# EAGLE design tm-feedback_main (EAGLE 7.6.0)
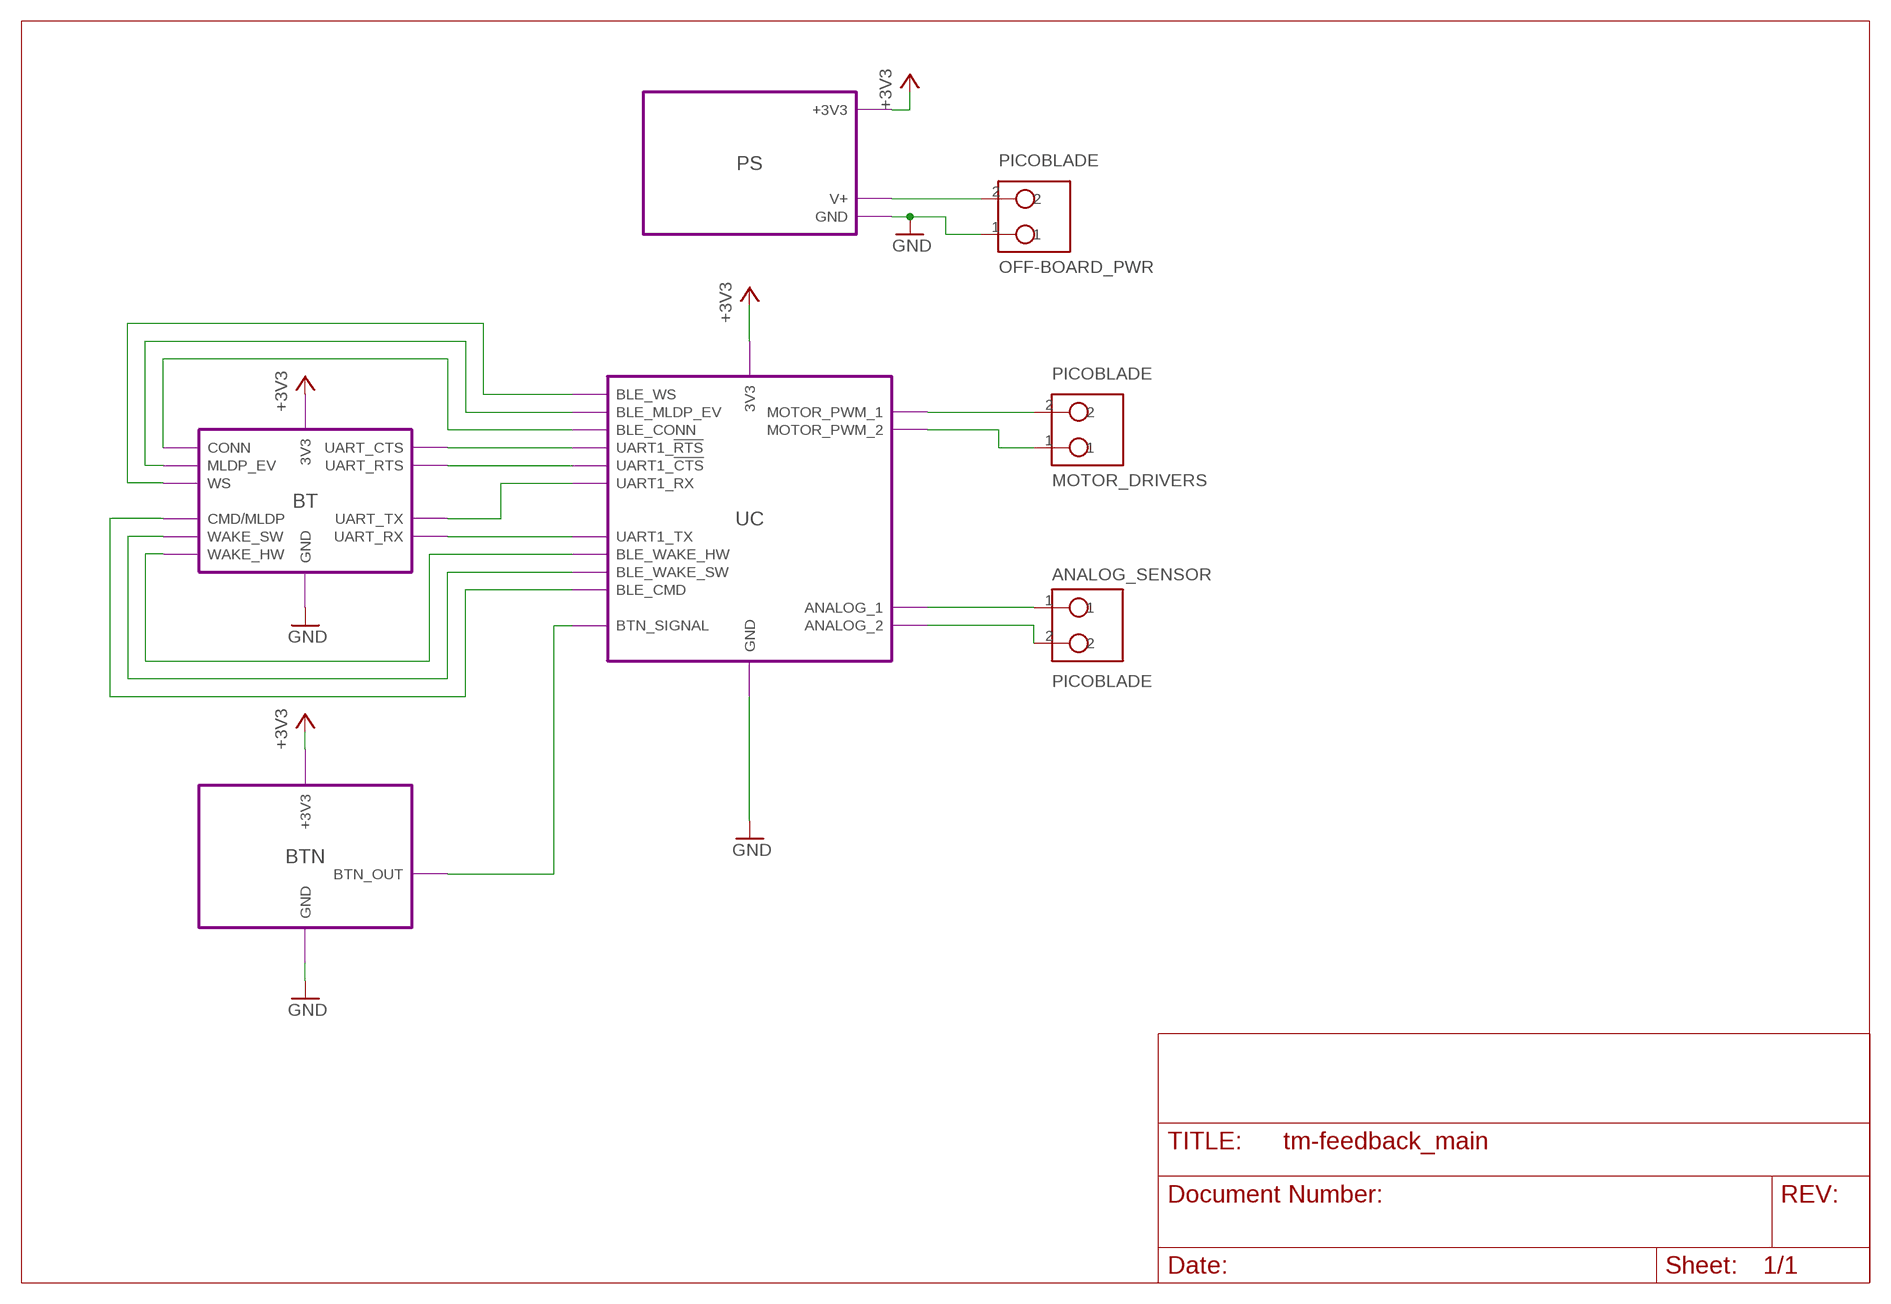
[diagram p0: schematic, sheet 1]

## Parts
ANALOG_SENSOR  PICOBLADE  [PICOBLADE]
MOTOR_DRIVERS  PICOBLADE  [PICOBLADE]
OFF-BOARD_PWR  PICOBLADE  [PICOBLADE]

## Module instances
BT = BLUETOOTH
UC = MICROCONTROLLER
BTN = BUTTON
PS = POWER_SUPPLY

## Nets
+3V3: port PS.+3V3 UC.3V3 BTN.+3V3 BT.3V3
GND: OFF-BOARD_PWR.1 ; port PS.GND BT.GND UC.GND BTN.GND
N$1: port BTN.BTN_OUT UC.BTN_SIGNAL
N$2: port BT.UART_CTS UC.UART1_!RTS
N$5: OFF-BOARD_PWR.2 ; port PS.V+
N$6: port BT.UART_RTS UC.UART1_!CTS
N$7: port BT.UART_TX UC.UART1_RX
N$8: port BT.UART_RX UC.UART1_TX
N$9: port BT.WAKE_HW UC.BLE_WAKE_HW
N$10: port BT.WAKE_SW UC.BLE_WAKE_SW
N$11: port BT.CMD/MLDP UC.BLE_CMD
N$12: port BT.CONN UC.BLE_CONN
N$13: port BT.MLDP_EV UC.BLE_MLDP_EV
N$14: port BT.WS UC.BLE_WS
N$15: ANALOG_SENSOR.1 ; port UC.ANALOG_1
N$16: ANALOG_SENSOR.2 ; port UC.ANALOG_2
PWM_1: MOTOR_DRIVERS.2 ; port UC.MOTOR_PWM_1
PWM_2: MOTOR_DRIVERS.1 ; port UC.MOTOR_PWM_2

## Library data of the parts
ANALOG_SENSOR MOTOR_DRIVERS OFF-BOARD_PWR = tactile-music:PICOBLADE: PICOBLADE connector

## Module BLUETOOTH
Ports: GND(pwr) UART_TX(out) UART_RX(in) UART_CTS(io) UART_RTS(io) CMD/MLDP(in) WAKE_SW(in) WAKE_HW(io) CONN(out) MLDP_EV(out) WS(out) 3V3(pwr)
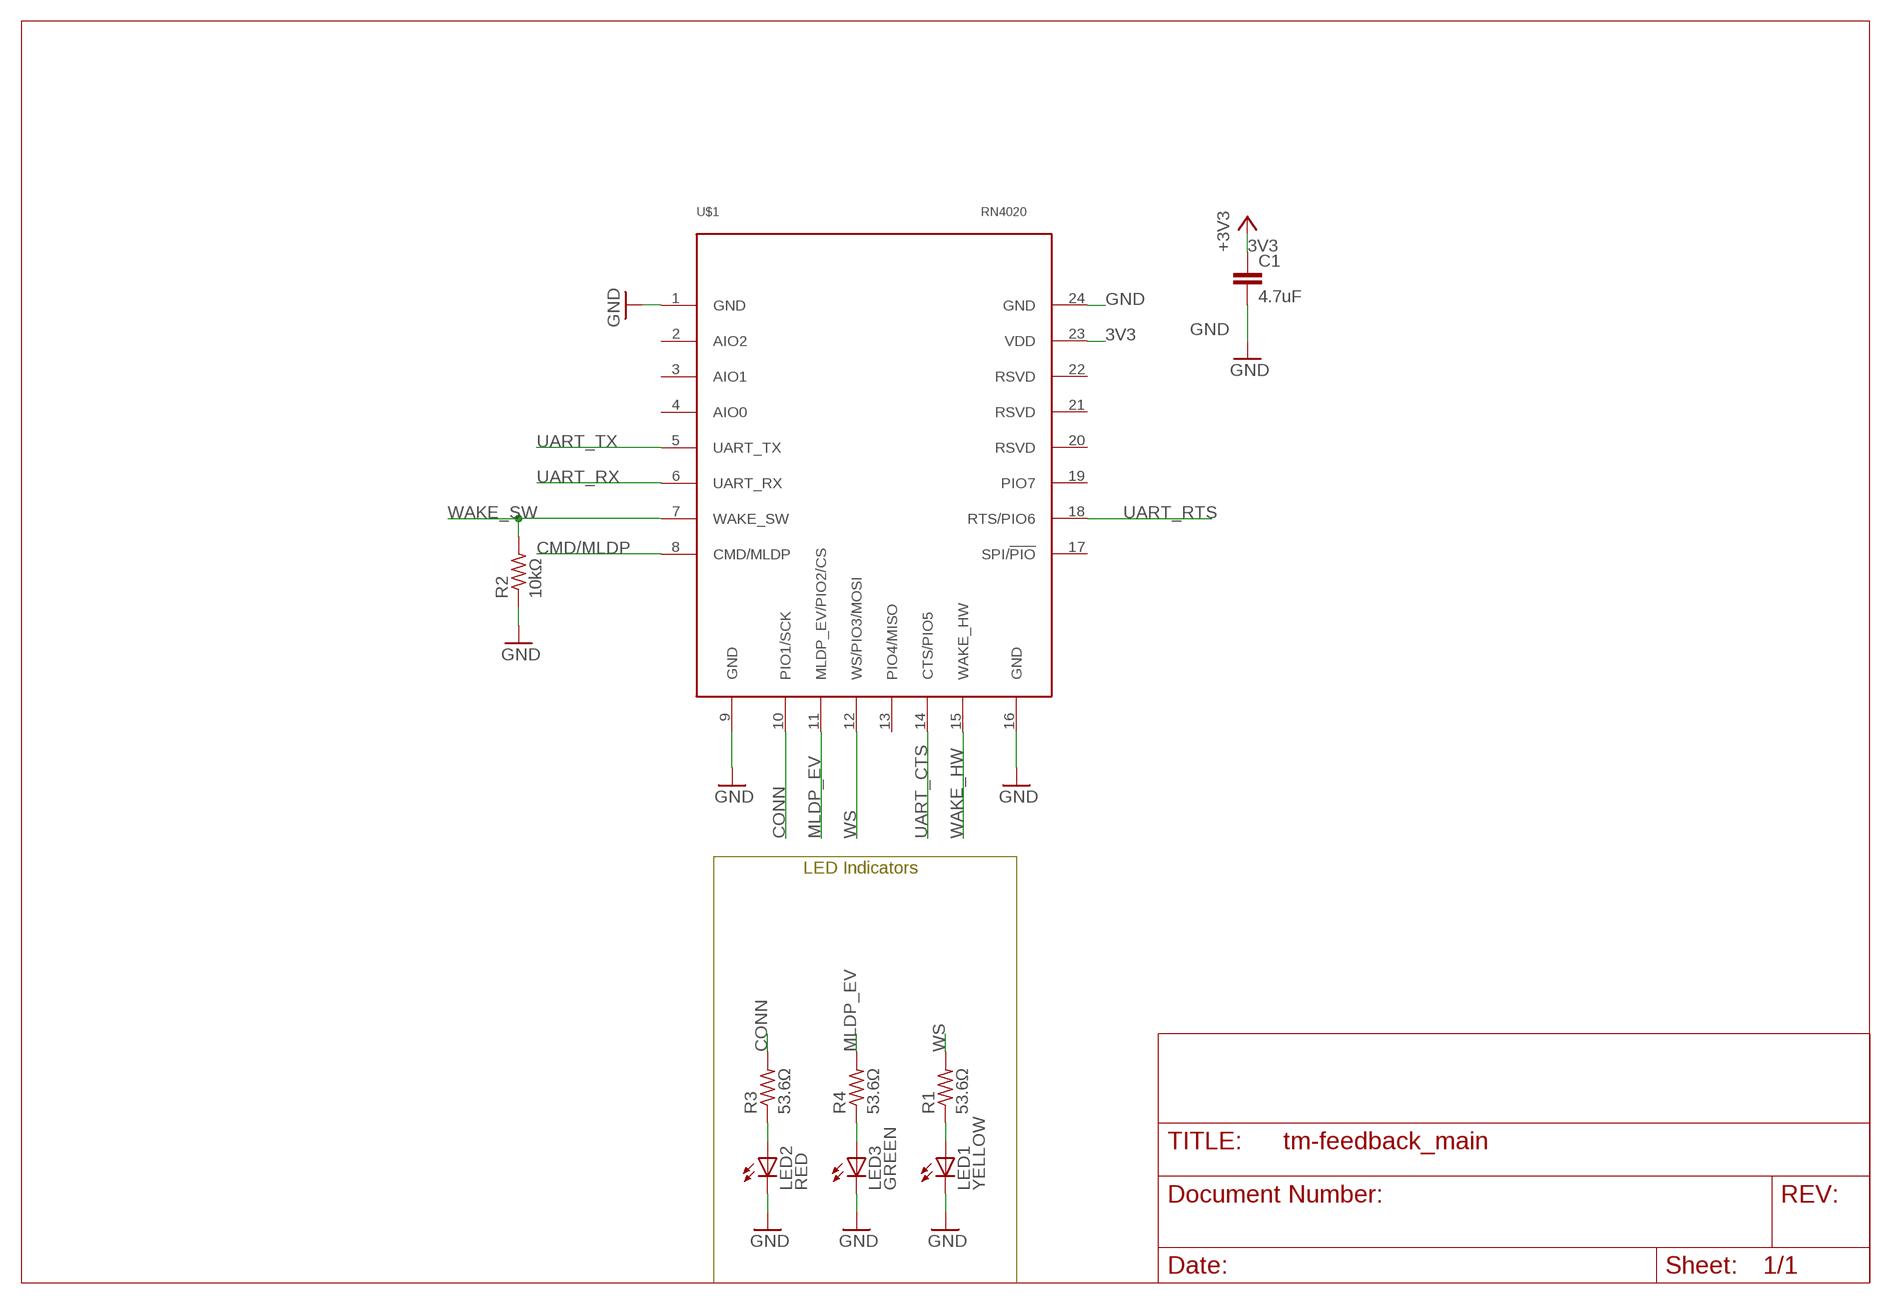
[diagram p1: schematic, module BLUETOOTH, sheet 1]

### Parts
C1  4.7uF  C-EUC0805  [C0805]
LED1  YELLOW  LEDCHIPLED_0805  [CHIPLED_0805]
LED2  RED  LEDCHIPLED_0805  [CHIPLED_0805]
LED3  GREEN  LEDCHIPLED_0805  [CHIPLED_0805]
R1  53.6Ω  R-US_R0805  [R0805]
R2  10kΩ  R-US_R0805  [R0805]
R3  53.6Ω  R-US_R0805  [R0805]
R4  53.6Ω  R-US_R0805  [R0805]
U$1  RN4020  [RN4020]

### Nets
3V3: C1.1 U$1.23(VDD) ; supply symbol labelled +3V3
CMD/MLDP: U$1.8(CMD/MLDP)
CONN: R3.2 U$1.10(PIO1/SCK)
GND: C1.2 LED1.C LED2.C LED3.C R2.1 U$1.1(GND) U$1.9(GND) U$1.16(GND) U$1.24(GND)
MLDP_EV: R4.2 U$1.11(MLDP_EV/PIO2/CS)
N$6: LED2.A R3.1
N$7: LED3.A R4.1
N$8: LED1.A R1.1
UART_CTS: U$1.14(CTS/PIO5)
UART_RTS: U$1.18(RTS/PIO6)
UART_RX: U$1.6(UART_RX)
UART_TX: U$1.5(UART_TX)
WAKE_HW: U$1.15(WAKE_HW)
WAKE_SW: R2.2 U$1.7(WAKE_SW)
WS: R1.2 U$1.12(WS/PIO3/MOSI)
Unconnected: U$1.2(AIO2) U$1.3(AIO1) U$1.4(AIO0) U$1.13(PIO4/MISO) U$1.17(SPI/!PIO) U$1.19(PIO7) U$1.20(RSVD) U$1.21(RSVD) U$1.22(RSVD)

### Notes on the sheet
- LED Indicators

### Library data of the parts
C1 = rcl:C-EU: CAPACITOR, European symbol
LED1-LED3 = led:LED: LED OSRAM: - CHIPLED LG R971, LG N971, LY N971, LG Q971, LY Q971, LO R971, LY R971 LH N974, LH R974 LS Q976, LO Q976, LY Q976 LO Q996 - Hyper CHIPLED LW Q18S LB Q993, LB Q99A, LB R99A - SideLED LS A670, LO A670, LY A670, LG A670, LP A670 LB A673, LV A673, LT A673, LW A673 LH A674 LY A675 LS A676, LA A676, LO A676, LY A676, LW A676 LS A679, LY A679, LG A679 - Hyper Micro SIDELED® LS Y876, LA Y876, LO Y876, LY Y876 LT Y87S - SmartLED LW L88C, LW L88S LB L89C, LB L89S, LG L890 LS L89K, LO L89K, LY L89K LS L896, LA L896, LO L896, LY L896 - TOPLED LS T670, LO T670, LY T670, LG T670, LP T670 LSG T670, LSP T670, LSY T670, LOP T670, LYG T670 LG T671, LOG T671, LSG T671 LB T673, LV T673, LT T673, LW T673 LH T674 LS T676, LA T676, LO T676, LY T676, LB T676, LH T676, LSB T676, LW T676 LB T67C, LV T67C, LT T67C, LS T67K, LO T67K, LY T67K, LW E67C LS E67B, LA E67B, LO E67B, LY E67B, LB E67C, LV E67C, LT E67C LW T67C LS T679, LY T679, LG T679 LS T770, LO T770, LY T770, LG T770, LP T770 LB T773, LV T773, LT T773, LW T773 LH T774 LS E675, LA E675, LY E675, LS T675 LS T776, LA T776, LO T776, LY T776, LB T776 LHGB T686 LT T68C, LB T68C - Hyper Mini TOPLED® LB M676 - Mini TOPLED Santana® LG M470 LS M47K, LO M47K, LY M47K Source: http://www.osram.convergy.de LUXEON: - LUMILED® LXK2-PW12-R00, LXK2-PW12-S00, LXK2-PW14-U00, LXK2-PW14-V00 LXK2-PM12-R00, LXK2-PM12-S00, LXK2-PM14-U00 LXK2-PE12-Q00, LXK2-PE12-R00, LXK2-PE12-S00, LXK2-PE14-T00, LXK2-PE14-U00 LXK2-PB12-K00, LXK2-PB12-L00, LXK2-PB12-M00, LXK2-PB14-N00, LXK2-PB14-P00, LXK2-PB14-Q00 LXK2-PR12-L00, LXK2-PR12-M00, LXK2-PR14-Q00, LXK2-PR14-R00 LXK2-PD12-Q00, LXK2-PD12-R00, LXK2-PD12-S00 LXK2-PH12-R00, LXK2-PH12-S00 LXK2-PL12-P00, LXK2-PL12-Q00, LXK2-PL12-R00 Source: www.luxeon.com KINGBRIGHT: KA-3528ASYC Source: www.kingbright.com
R1-R4 = resistor:R-US_: RESISTOR, American symbol
U$1 = tactile-music:RN4020: Microchip's RN4020 Bluetooth Module

## Module MICROCONTROLLER
Ports: 3V3(pwr) GND(pwr) MOTOR_PWM_1(out) MOTOR_PWM_2(out) BTN_SIGNAL(io) UART1_!CTS(io) UART1_!RTS(io) UART1_RX(io) UART1_TX(out) BLE_CONN(io) BLE_MLDP_EV(io) BLE_WS(io) BLE_WAKE_HW(out) BLE_WAKE_SW(out) BLE_CMD(out) ANALOG_2(io) ANALOG_1(io)
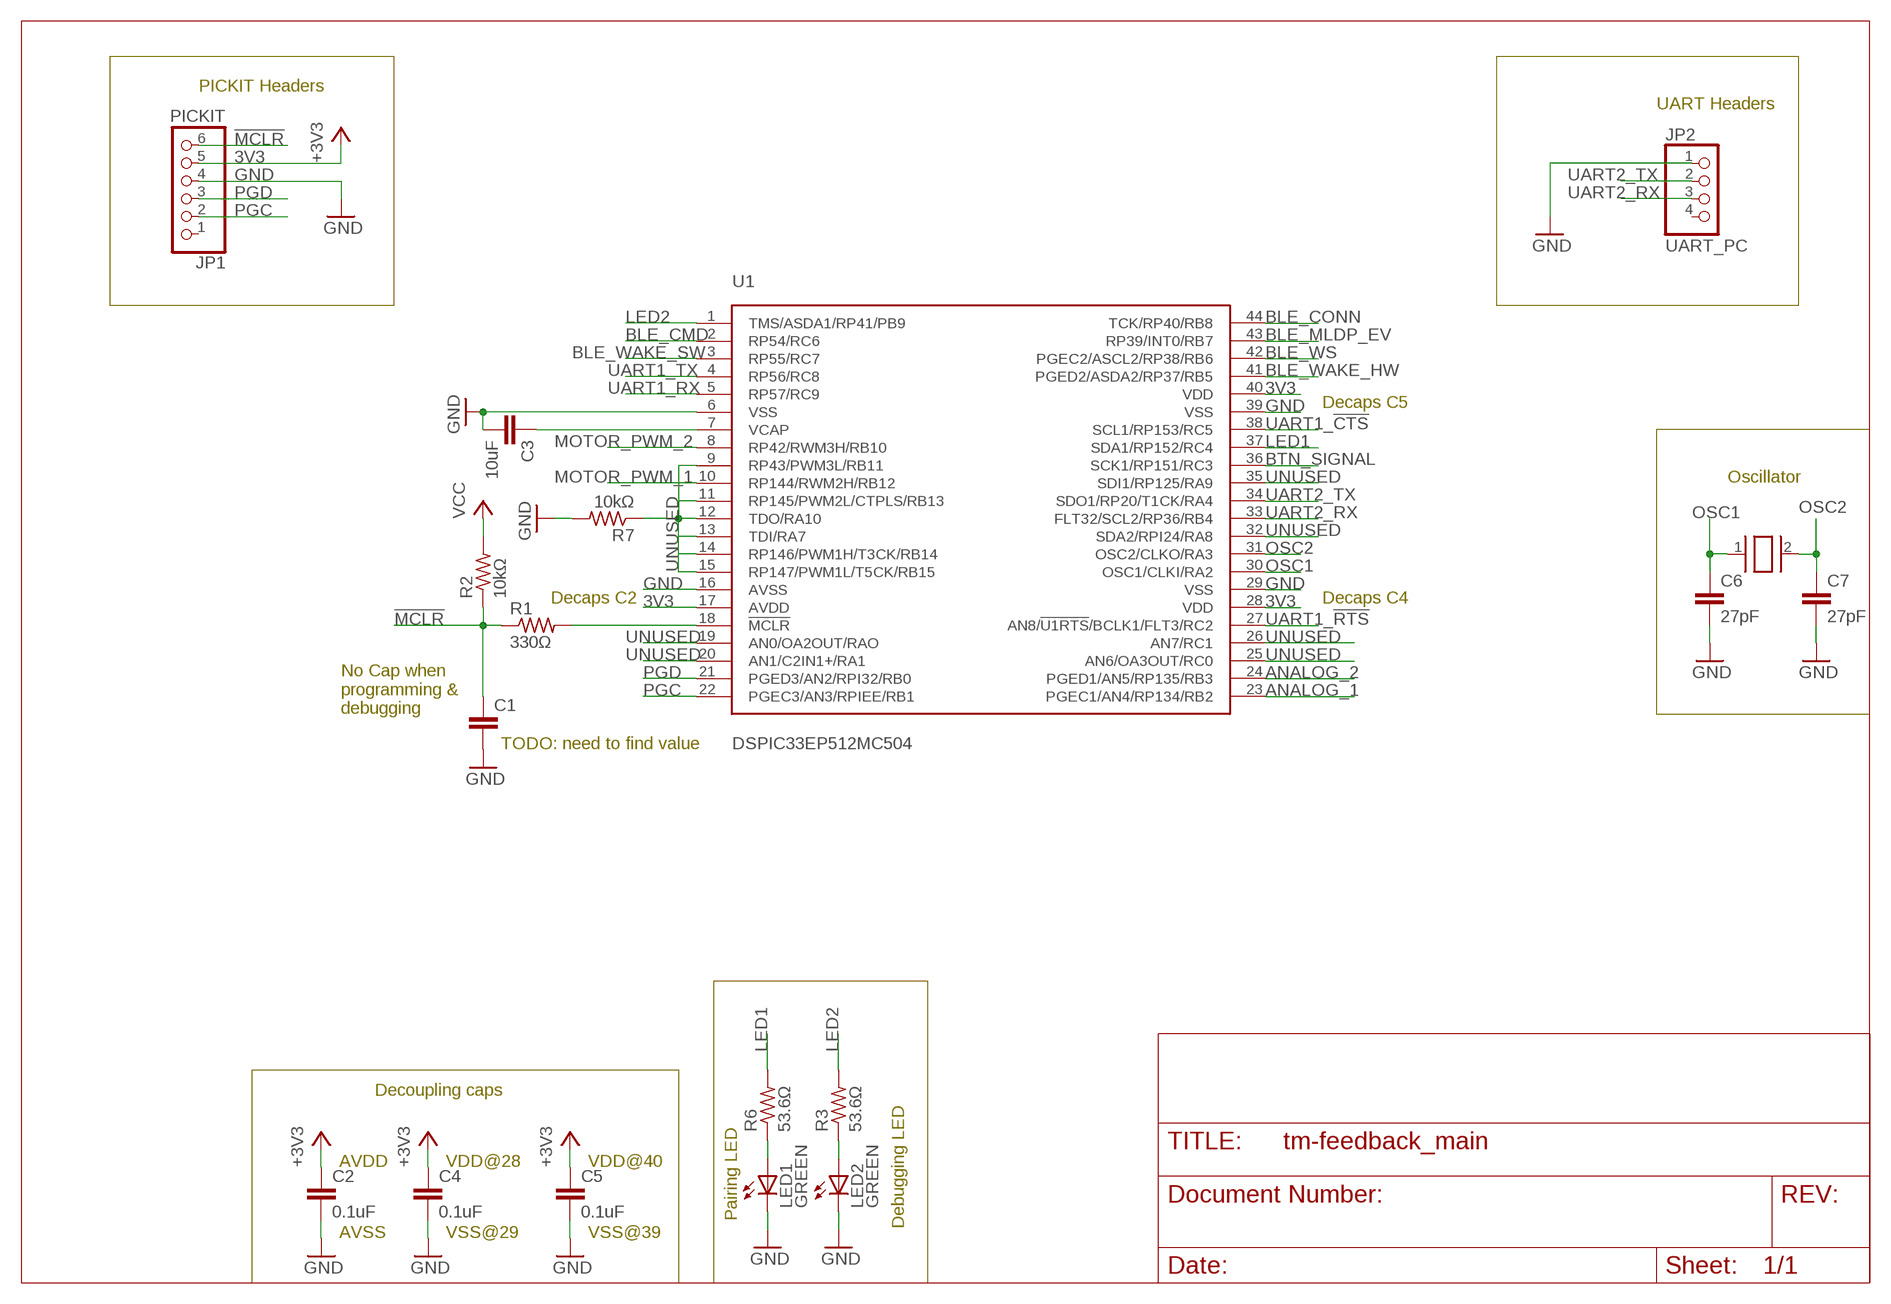
[diagram p2: schematic, module MICROCONTROLLER, sheet 1]

### Parts
C1  C-EUC0805  [C0805]
C2  0.1uF  C-EUC0805  [C0805]
C3  10uF  C-EUC0805  [C0805]
C4  0.1uF  C-EUC0805  [C0805]
C5  0.1uF  C-EUC0805  [C0805]
C6  27pF  C-EUC0805  [C0805]
C7  27pF  C-EUC0805  [C0805]
JP1  PICKIT  PINHEAD-1X6/90  [1X06/90]
JP2  UART_PC  PINHEAD-1X4/90  [1X04/90]
LED1  GREEN  LEDCHIPLED_0805  [CHIPLED_0805]
LED2  GREEN  LEDCHIPLED_0805  [CHIPLED_0805]
R1  330Ω  R-US_R0805  [R0805]
R2  10kΩ  R-US_R0805  [R0805]
R3  53.6Ω  R-US_R0805  [R0805]
R6  53.6Ω  R-US_R0805  [R0805]
R7  10kΩ  R-US_R0805  [R0805]
U1  DSPIC33EP512MC504  [TQFP44]
U2  XTAL_ABLS7M2  [XTAL_ABLS7M2]

### Nets
3V3: C2.1 C4.1 C5.1 JP1.5 R2.2 U1.17(AVDD) U1.28(VDD) U1.40(VDD) ; supply symbol labelled VCC, +3V3
!MCLR: C1.1 JP1.6 R1.1 R2.1
ANALOG_1: U1.23(PGEC1/AN4/RP134/RB2)
ANALOG_2: U1.24(PGED1/AN5/RP135/RB3)
BLE_CMD: U1.2(RP54/RC6)
BLE_CONN: U1.44(TCK/RP40/RB8)
BLE_MLDP_EV: U1.43(RP39/INT0/RB7)
BLE_WAKE_HW: U1.41(PGED2/ASDA2/RP37/RB5)
BLE_WAKE_SW: U1.3(RP55/RC7)
BLE_WS: U1.42(PGEC2/ASCL2/RP38/RB6)
BTN_SIGNAL: U1.36(SCK1/RP151/RC3)
GND: C1.2 C2.2 C3.2 C4.2 C5.2 C6.2 C7.2 JP1.4 JP2.1 LED1.C LED2.C R7.2 U1.6(VSS) U1.16(AVSS) U1.29(VSS) U1.39(VSS)
LED1: R6.2 U1.37(SDA1/RP152/RC4)
LED2: R3.2 U1.1(TMS/ASDA1/RP41/PB9)
MOTOR_PWM_1: U1.10(RP144/RWM2H/RB12)
MOTOR_PWM_2: U1.8(RP42/RWM3H/RB10)
N$1: R1.2 U1.18(!MCLR)
N$3: C3.1 U1.7(VCAP)
N$4: LED2.A R3.1
N$10: LED1.A R6.1
OSC1: C6.1 U1.30(OSC1/CLKI/RA2) U2.1
OSC2: C7.1 U1.31(OSC2/CLKO/RA3) U2.2
PGC: JP1.2 U1.22(PGEC3/AN3/RPIEE/RB1)
PGD: JP1.3 U1.21(PGED3/AN2/RPI32/RB0)
UART1_!CTS: U1.38(SCL1/RP153/RC5)
UART1_!RTS: U1.27(AN8/!U1RTS!/BCLK1/FLT3/RC2)
UART1_RX: U1.5(RP57/RC9)
UART1_TX: U1.4(RP56/RC8)
UART2_RX: JP2.3 U1.33(FLT32/SCL2/RP36/RB4)
UART2_TX: JP2.2 U1.34(SDO1/RP20/T1CK/RA4)
UNUSED: R7.1 U1.9(RP43/PWM3L/RB11) U1.11(RP145/PWM2L/CTPLS/RB13) U1.12(TDO/RA10) U1.13(TDI/RA7) U1.14(RP146/PWM1H/T3CK/RB14) U1.15(RP147/PWM1L/T5CK/RB15) U1.19(AN0/OA2OUT/RAO) U1.20(AN1/C2IN1+/RA1) U1.25(AN6/OA3OUT/RC0) U1.26(AN7/RC1) U1.32(SDA2/RPI24/RA8) U1.35(SDI1/RP125/RA9)
Unconnected: JP1.1 JP2.4

### Notes on the sheet
- PICKIT Headers
- UART Headers
- Decaps C5
- Oscillator
- Decaps C2 | Decaps C4
- No Cap when 
  programming & 
  debugging
- TODO: need to find value
- Decoupling caps
- Debugging LED
- AVDD | VDD@28 | VDD@40
- Pairing LED
- AVSS | VSS@29 | VSS@39

### Library data of the parts
C1-C7 = rcl:C-EU: CAPACITOR, European symbol
JP1 = tactile-music:PINHEAD-1X6: PIN HEADER
JP2 = tactile-music:PINHEAD-1X4: PIN HEADER
LED1 LED2 = led:LED: LED OSRAM: - CHIPLED LG R971, LG N971, LY N971, LG Q971, LY Q971, LO R971, LY R971 LH N974, LH R974 LS Q976, LO Q976, LY Q976 LO Q996 - Hyper CHIPLED LW Q18S LB Q993, LB Q99A, LB R99A - SideLED LS A670, LO A670, LY A670, LG A670, LP A670 LB A673, LV A673, LT A673, LW A673 LH A674 LY A675 LS A676, LA A676, LO A676, LY A676, LW A676 LS A679, LY A679, LG A679 - Hyper Micro SIDELED® LS Y876, LA Y876, LO Y876, LY Y876 LT Y87S - SmartLED LW L88C, LW L88S LB L89C, LB L89S, LG L890 LS L89K, LO L89K, LY L89K LS L896, LA L896, LO L896, LY L896 - TOPLED LS T670, LO T670, LY T670, LG T670, LP T670 LSG T670, LSP T670, LSY T670, LOP T670, LYG T670 LG T671, LOG T671, LSG T671 LB T673, LV T673, LT T673, LW T673 LH T674 LS T676, LA T676, LO T676, LY T676, LB T676, LH T676, LSB T676, LW T676 LB T67C, LV T67C, LT T67C, LS T67K, LO T67K, LY T67K, LW E67C LS E67B, LA E67B, LO E67B, LY E67B, LB E67C, LV E67C, LT E67C LW T67C LS T679, LY T679, LG T679 LS T770, LO T770, LY T770, LG T770, LP T770 LB T773, LV T773, LT T773, LW T773 LH T774 LS E675, LA E675, LY E675, LS T675 LS T776, LA T776, LO T776, LY T776, LB T776 LHGB T686 LT T68C, LB T68C - Hyper Mini TOPLED® LB M676 - Mini TOPLED Santana® LG M470 LS M47K, LO M47K, LY M47K Source: http://www.osram.convergy.de LUXEON: - LUMILED® LXK2-PW12-R00, LXK2-PW12-S00, LXK2-PW14-U00, LXK2-PW14-V00 LXK2-PM12-R00, LXK2-PM12-S00, LXK2-PM14-U00 LXK2-PE12-Q00, LXK2-PE12-R00, LXK2-PE12-S00, LXK2-PE14-T00, LXK2-PE14-U00 LXK2-PB12-K00, LXK2-PB12-L00, LXK2-PB12-M00, LXK2-PB14-N00, LXK2-PB14-P00, LXK2-PB14-Q00 LXK2-PR12-L00, LXK2-PR12-M00, LXK2-PR14-Q00, LXK2-PR14-R00 LXK2-PD12-Q00, LXK2-PD12-R00, LXK2-PD12-S00 LXK2-PH12-R00, LXK2-PH12-S00 LXK2-PL12-P00, LXK2-PL12-Q00, LXK2-PL12-R00 Source: www.luxeon.com KINGBRIGHT: KA-3528ASYC Source: www.kingbright.com
R1-R3 R6 R7 = resistor:R-US_: RESISTOR, American symbol
U1 = tactile-music:DSPIC33EP512MC504: DSPIC33EP512MC504 PIC with Digital Signal Processor from microchip.
U2 = tactile-music:XTAL_ABLS7M2

## Module BUTTON
Ports: BTN_OUT(out) GND(pwr) +3V3(pwr)
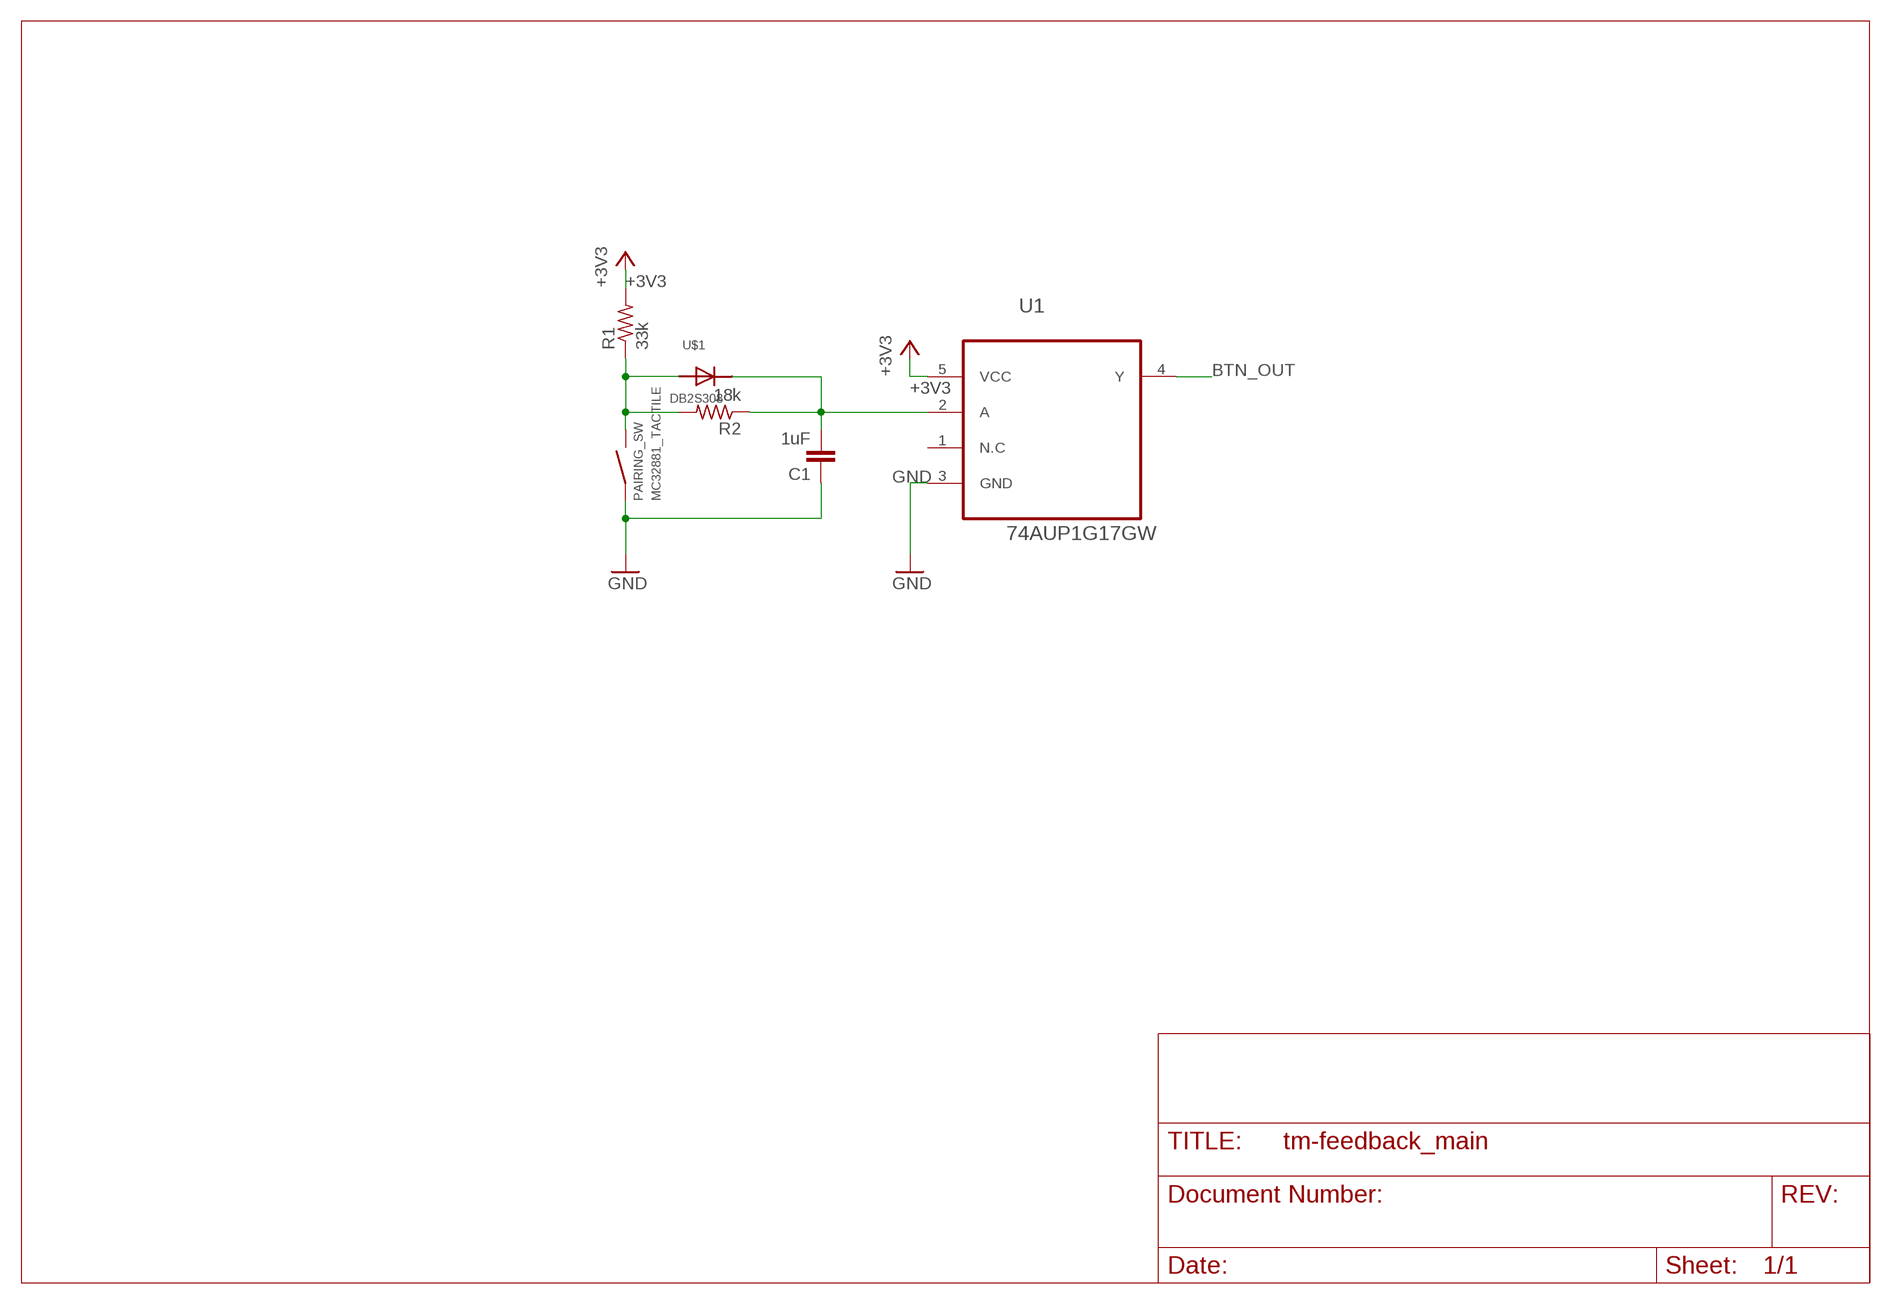
[diagram p3: schematic, module BUTTON, sheet 1]

### Parts
C1  1uF  C-EUC0805  [C0805]
PAIRING_SW  MC32881_TACTILE  [THRU-TACTILE-BTN]
R1  33k  R-US_R0805  [R0805]
R2  18k  R-US_R0805  [R0805]
U1  74AUP1G17GW  [SOT65P212X110-5N]
U$1  DB2S308  [SOD-523]

### Nets
+3V3: R1.2 U1.5(VCC)
BTN_OUT: U1.4(Y)
GND: C1.1 PAIRING_SW.P$1 U1.3(GND)
N$1: PAIRING_SW.P$2 R1.1 R2.2 U$1.2(ANODE)
N$2: C1.2 R2.1 U1.2(A) U$1.1(CATHODE)
Unconnected: U1.1(N.C)

### Library data of the parts
C1 = rcl:C-EU: CAPACITOR, European symbol
PAIRING_SW = tactile-music:MC32881_TACTILE: Tactile button
R1 R2 = resistor:R-US_: RESISTOR, American symbol
U1 = tactile-music:74AUP1G17GW: IC, BUFF SCHMT TRIG, LOW PWR, TSSOP-5; MPN: 74AUP1G17GW; OC_FARNELL: 2164682; OC_NEWARK: 55W4625; PACKAGE: TSSOP-5; SUPPLIER: NXP
U$1 = tactile-music:DB2S308: Panasonic's DB2S308 Schottky Diode

## Module POWER_SUPPLY
Ports: V+(pwr) GND(pwr) +3V3(pwr)
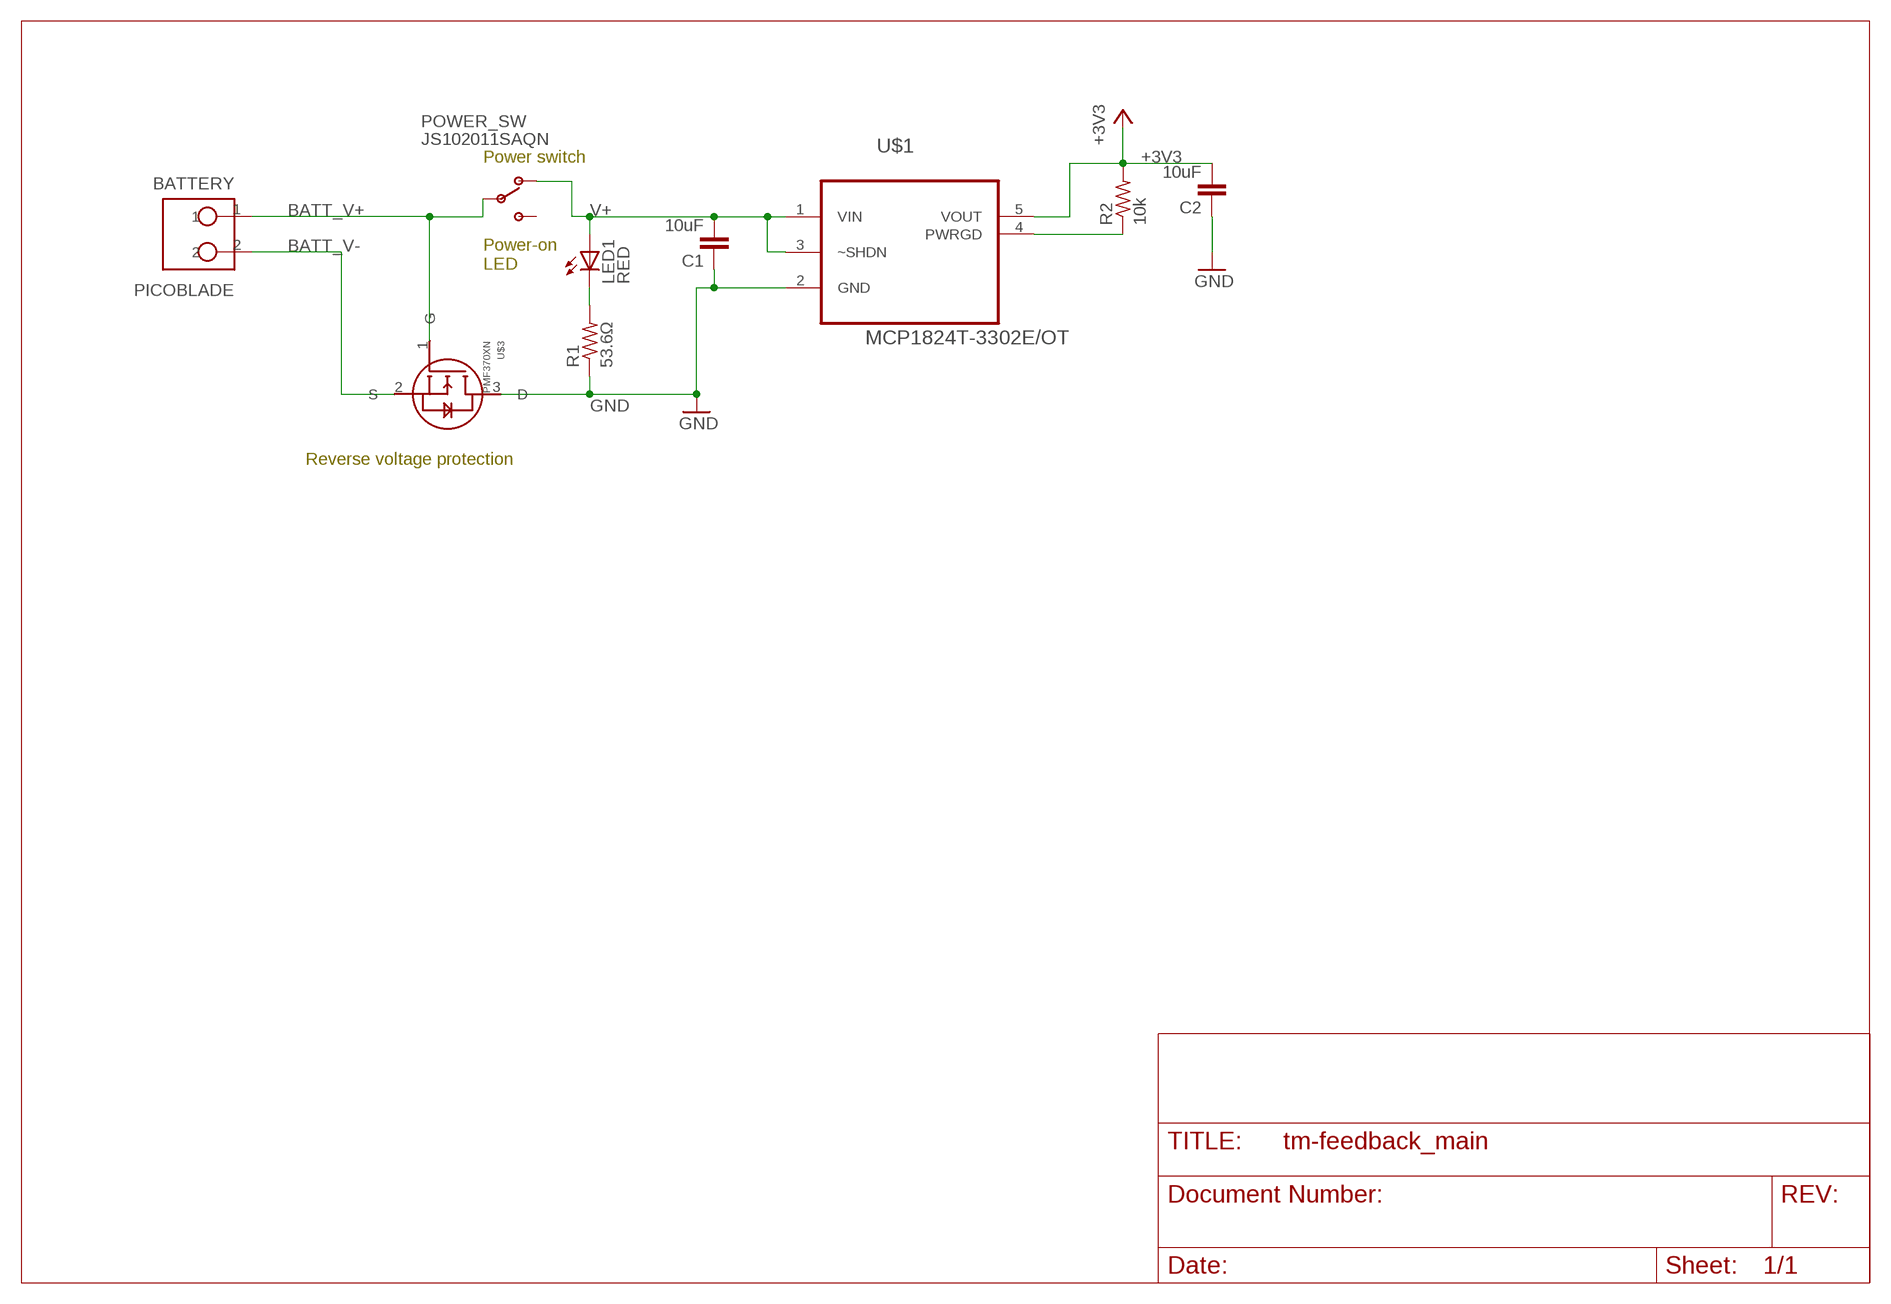
[diagram p4: schematic, module POWER_SUPPLY, sheet 1]

### Parts
BATTERY  PICOBLADE  [PICOBLADE]
C1  10uF  C-EUC0805  [C0805]
C2  10uF  C-EUC0805  [C0805]
LED1  RED  LEDCHIPLED_0805  [CHIPLED_0805]
POWER_SW  JS102011SAQN  [JS102011SAQN]
R1  53.6Ω  R-US_R0805  [R0805]
R2  10k  R-US_R0805  [R0805]
U$1  MCP1824T-3302E/OT  [SOT95P270X145-5N]
U$3  PMF370XN  [SOT323(SC-70)]

### Nets
+3V3: C2.2 R2.2 U$1.5(VOUT)
BATT_V+: BATTERY.1 POWER_SW.2(C) U$3.1(G)
BATT_V-: BATTERY.2 U$3.2(S)
GND: C1.1 C2.1 R1.1 U$1.2(GND) U$3.3(D)
N$3: LED1.C R1.2
PWRGD: R2.1 U$1.4(PWRGD)
V+: C1.2 LED1.A POWER_SW.1 U$1.1(VIN) U$1.3(~SHDN)
Unconnected: POWER_SW.3

### Notes on the sheet
- Power switch
- Power-on 
  LED
- Reverse voltage protection

### Library data of the parts
BATTERY = tactile-music:PICOBLADE: PICOBLADE connector
C1 C2 = rcl:C-EU: CAPACITOR, European symbol
LED1 = led:LED: LED OSRAM: - CHIPLED LG R971, LG N971, LY N971, LG Q971, LY Q971, LO R971, LY R971 LH N974, LH R974 LS Q976, LO Q976, LY Q976 LO Q996 - Hyper CHIPLED LW Q18S LB Q993, LB Q99A, LB R99A - SideLED LS A670, LO A670, LY A670, LG A670, LP A670 LB A673, LV A673, LT A673, LW A673 LH A674 LY A675 LS A676, LA A676, LO A676, LY A676, LW A676 LS A679, LY A679, LG A679 - Hyper Micro SIDELED® LS Y876, LA Y876, LO Y876, LY Y876 LT Y87S - SmartLED LW L88C, LW L88S LB L89C, LB L89S, LG L890 LS L89K, LO L89K, LY L89K LS L896, LA L896, LO L896, LY L896 - TOPLED LS T670, LO T670, LY T670, LG T670, LP T670 LSG T670, LSP T670, LSY T670, LOP T670, LYG T670 LG T671, LOG T671, LSG T671 LB T673, LV T673, LT T673, LW T673 LH T674 LS T676, LA T676, LO T676, LY T676, LB T676, LH T676, LSB T676, LW T676 LB T67C, LV T67C, LT T67C, LS T67K, LO T67K, LY T67K, LW E67C LS E67B, LA E67B, LO E67B, LY E67B, LB E67C, LV E67C, LT E67C LW T67C LS T679, LY T679, LG T679 LS T770, LO T770, LY T770, LG T770, LP T770 LB T773, LV T773, LT T773, LW T773 LH T774 LS E675, LA E675, LY E675, LS T675 LS T776, LA T776, LO T776, LY T776, LB T776 LHGB T686 LT T68C, LB T68C - Hyper Mini TOPLED® LB M676 - Mini TOPLED Santana® LG M470 LS M47K, LO M47K, LY M47K Source: http://www.osram.convergy.de LUXEON: - LUMILED® LXK2-PW12-R00, LXK2-PW12-S00, LXK2-PW14-U00, LXK2-PW14-V00 LXK2-PM12-R00, LXK2-PM12-S00, LXK2-PM14-U00 LXK2-PE12-Q00, LXK2-PE12-R00, LXK2-PE12-S00, LXK2-PE14-T00, LXK2-PE14-U00 LXK2-PB12-K00, LXK2-PB12-L00, LXK2-PB12-M00, LXK2-PB14-N00, LXK2-PB14-P00, LXK2-PB14-Q00 LXK2-PR12-L00, LXK2-PR12-M00, LXK2-PR14-Q00, LXK2-PR14-R00 LXK2-PD12-Q00, LXK2-PD12-R00, LXK2-PD12-S00 LXK2-PH12-R00, LXK2-PH12-S00 LXK2-PL12-P00, LXK2-PL12-Q00, LXK2-PL12-R00 Source: www.luxeon.com KINGBRIGHT: KA-3528ASYC Source: www.kingbright.com
POWER_SW = tactile-music:JS102011SAQN: SPDT Switch
R1 R2 = resistor:R-US_: RESISTOR, American symbol
U$1 = tactile-music:MCP1824T-3302E/OT: 300 mA, Low Voltage, Low Quiescent Current LDO Regulator; MPN: MCP1824T-3302E/OT; OC_FARNELL: 1578387; OC_NEWARK: 40M0704; PACKAGE: SOT23-5; SUPPLIER: Microchip
U$3 = tactile-music:PMF370XN: MOSFET

## Board
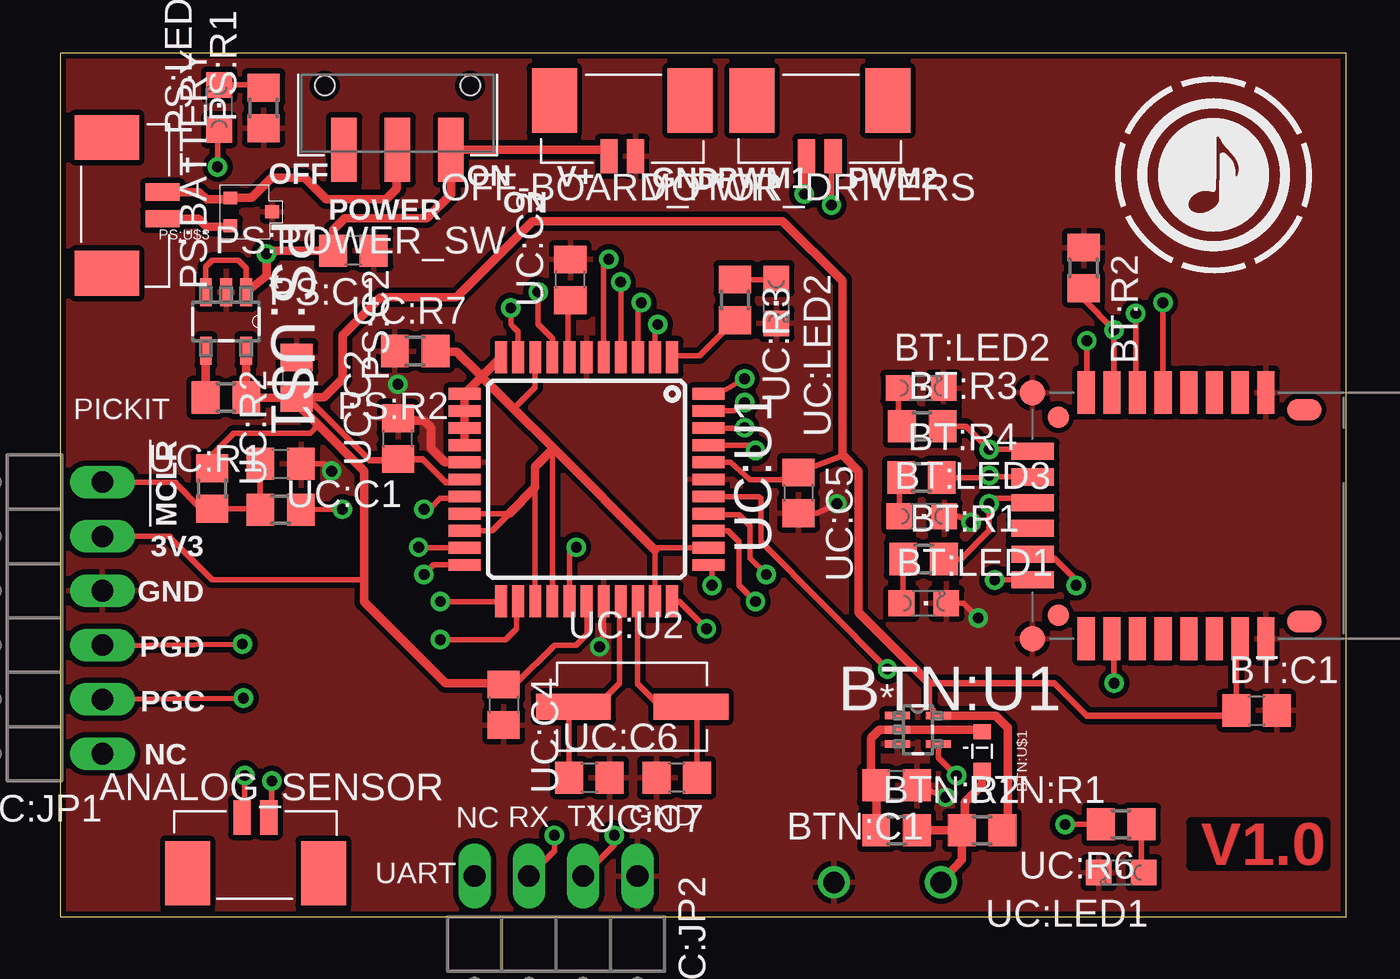
[diagram p5: board, top side]
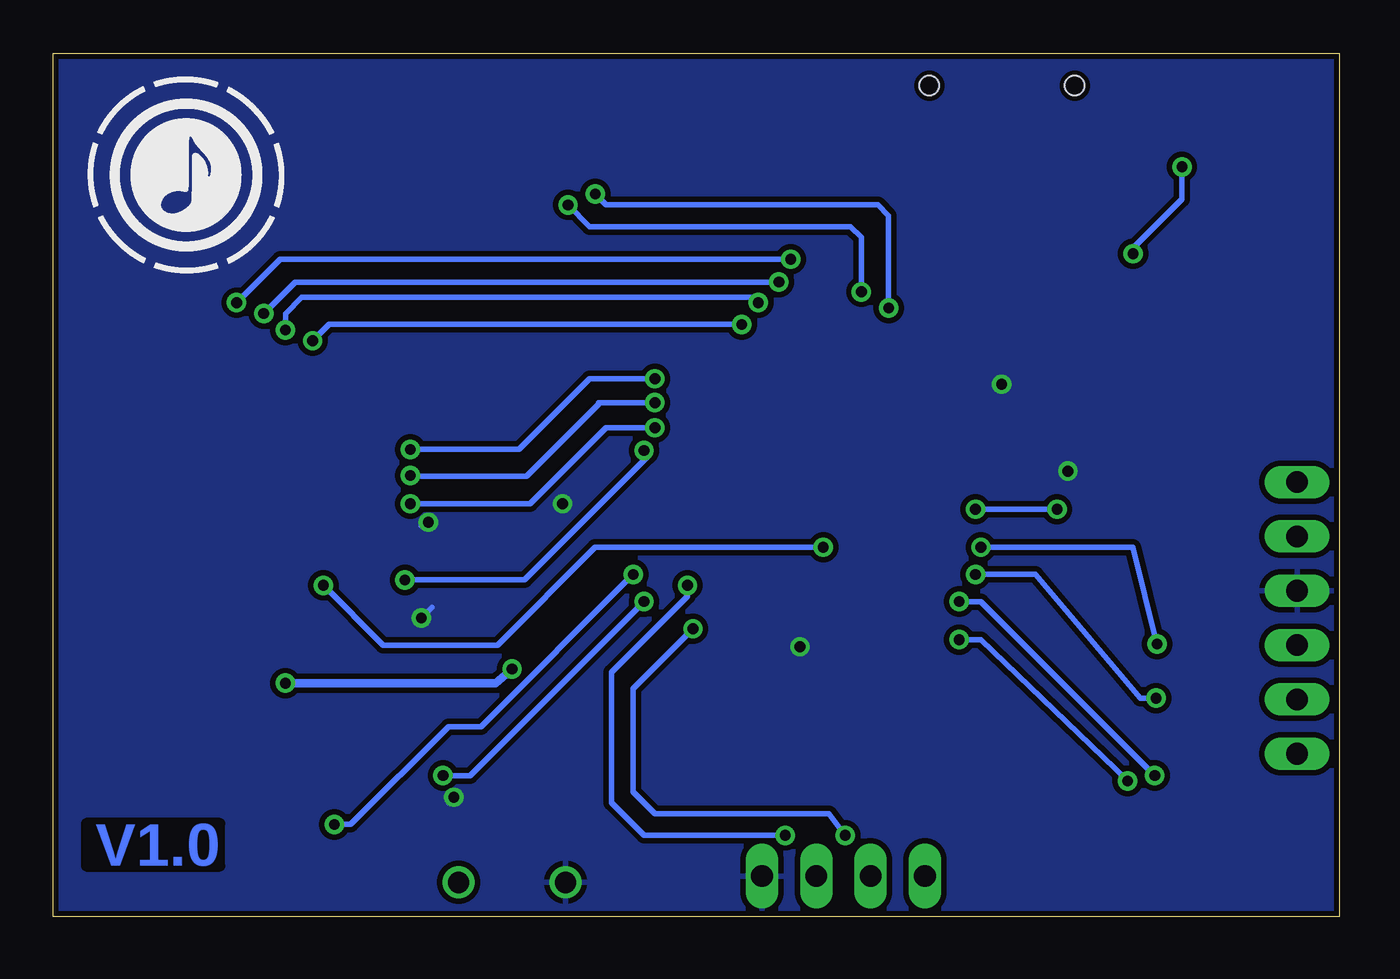
[diagram p6: board, bottom side, seen from below]

Size 60.12 x 40.35 mm. Coordinates in mm from the lower left corner, seen from the top.
Outline: 0,0 60.12,0 60.12,40.35 0,40.35 0,0
Copper layers (1*16): Top 0.035mm / dielectric 1.5mm / Bottom 0.035mm
Design rules "default *": minimum track width 10mil, minimum drill 0.5mm, track to track 8mil, track to pad 8mil, pad to pad 8mil, via to via 8mil, smd to smd 8mil, copper to edge 10mil, drill to drill 10mil, minimum pad ring 10mil, minimum via ring 8mil, stop-mask expansion 4mil, vias tented up to drill 0mil, thermal gap 10mil

### Footprints (pad centres in the part's own frame; a part is rotated, then mirrored left to right if it is on the bottom)
PICOBLADE = smd 0.8 x 1.6: 1 -0.625,1.8; 2 0.625,1.8 | smd 2.1 x 3: P$1 -3.175,-0.8; P$2 3.175,-0.8
C0805 = smd 1.3 x 1.5: 1 -0.95,0; 2 0.95,0
CHIPLED_0805 = smd 1.2 x 1.2: A 0,-1.05; C 0,1.05
R0805 = smd 1.3 x 1.5: 1 -0.95,0; 2 0.95,0
RN4020 = smd 2 x 0.8: 1 -5.75,1.15; 2 -5.75,-0.05; 3 -5.75,-1.25; 4 -5.75,-2.45; 5 -5.75,-3.65; 6 -5.75,-4.85; 7 -5.75,-6.05; 8 -5.75,-7.25; 17 5.75,-7.25; 18 5.75,-6.05; 19 5.75,-4.85; 20 5.75,-3.65; 21 5.75,-2.45; 22 5.75,-1.25; 23 5.75,-0.05; 24 5.75,1.15 | smd 1 x 1.6: 1A -4.95,2.95; 24A 4.95,2.95 | smd 1.2 x 1.2: 9 -5.75,-9.75; 16 5.75,-9.75 | smd 1 x 1: 9A -4.6,-8.55; 16A 4.65,-8.55 | smd 0.8 x 2: 10 -3,-9.75; 11 -1.8,-9.75; 12 -0.6,-9.75; 13 0.6,-9.75; 14 1.8,-9.75; 15 3,-9.75
THRU-TACTILE-BTN = drill 1: P$1 2.5,0; P$2 -2.5,0
SOT65P212X110-5N = smd 1.168 x 0.356: 1 -0.965,0.66; 2 -0.965,0; 3 -0.965,-0.66; 4 0.965,-0.66; 5 0.965,0.66
SOD-523 = smd 0.8 x 0.7: 1 0,-0.9; 2 0,0.9
JS102011SAQN = smd 1.2 x 3: 1 -2.5,1.5; 2 0,1.5; 3 2.5,1.5 | hole 0.9: 3.4,-1.5; -3.4,-1.5
SOT95P270X145-5N = smd 1.321 x 0.559: 1 -1.372,0.94; 2 -1.372,0; 3 -1.372,-0.94; 4 1.372,-0.94; 5 1.372,0.94
SOT323(SC-70) = smd 0.65 x 0.6: 1 1.05,-0.65; 2 1.05,0.65; 3 -0.9,0
1X06/90 = drill 1.016 long: 1 -6.35,-3.81; 2 -3.81,-3.81; 3 -1.27,-3.81; 4 1.27,-3.81; 5 3.81,-3.81; 6 6.35,-3.81
1X04/90 = drill 1.016 long: 1 -3.81,-3.81; 2 -1.27,-3.81; 3 1.27,-3.81; 4 3.81,-3.81
TQFP44 = smd 1.5 x 0.55: 1 -5.7,4; 2 -5.7,3.2; 3 -5.7,2.4; 4 -5.7,1.6; 5 -5.7,0.8; 6 -5.7,0; 7 -5.7,-0.8; 8 -5.7,-1.6; 9 -5.7,-2.4; 10 -5.7,-3.2; 11 -5.7,-4; 23 5.7,-4; 24 5.7,-3.2; 25 5.7,-2.4; 26 5.7,-1.6; 27 5.7,-0.8; 28 5.7,0; 29 5.7,0.8; 30 5.7,1.6; 31 5.7,2.4; 32 5.7,3.2; 33 5.7,4 | smd 0.55 x 1.5: 12 -4,-5.7; 13 -3.2,-5.7; 14 -2.4,-5.7; 15 -1.6,-5.7; 16 -0.8,-5.7; 17 0,-5.7; 18 0.8,-5.7; 19 1.6,-5.7; 20 2.4,-5.7; 21 3.2,-5.7; 22 4,-5.7; 34 4,5.7; 35 3.2,5.7; 36 2.4,5.7; 37 1.6,5.7; 38 0.8,5.7; 39 0,5.7; 40 -0.8,5.7; 41 -1.6,5.7; 42 -2.4,5.7; 43 -3.2,5.7; 44 -4,5.7
XTAL_ABLS7M2 = smd 3.5 x 1.2: 1 -2.75,0; 2 2.75,0

### Placement (x,y rotation side)
ANALOG_SENSOR  9.14,2.84 0 top
BT:C1  4.7uF  [C0805]  55.94,9.64 0 top
BT:LED1  YELLOW  [CHIPLED_0805]  40.38,14.66 270 top
BT:LED2  RED  [CHIPLED_0805]  40.26,24.71 270 top
BT:LED3  GREEN  [CHIPLED_0805]  40.29,18.72 270 top
BT:R1  53.6Ω  [R0805]  40.37,16.72 0 top
BT:R2  10kΩ  [R0805]  47.86,30.33 270 top
BT:R3  53.6Ω  [R0805]  40.31,22.93 0 top
BT:R4  53.6Ω  [R0805]  40.27,20.53 0 top
BT:U$1  RN4020  [RN4020]  55.22,18.75 270 top
BTN:C1  1uF  [C0805]  39.11,6.15 180 top
BTN:PAIRING_SW  MC32881_TACTILE  [THRU-TACTILE-BTN]  38.68,1.61 0 bottom
BTN:R1  33k  [R0805]  43.11,4.05 0 top
BTN:R2  18k  [R0805]  39.11,4.05 0 top
BTN:U1  74AUP1G17GW  [SOT65P212X110-5N]  40.11,8.75 0 top
BTN:U$1  DB2S308  [SOD-523]  43.11,7.75 180 top
MOTOR_DRIVERS  35.52,37.35 180 top
OFF-BOARD_PWR  26.29,37.35 180 top
PS:BATTERY  PICOBLADE  [PICOBLADE]  3,33.25 270 top
PS:C1  10uF  [C0805]  13.72,31.14 180 top
PS:C2  10uF  [C0805]  11.06,25.19 270 top
PS:LED1  RED  [CHIPLED_0805]  7.44,37.83 0 top
PS:POWER_SW  JS102011SAQN  [JS102011SAQN]  15.78,37.35 180 top
PS:R1  53.6Ω  [R0805]  9.52,37.8 90 top
PS:R2  10k  [R0805]  7.76,24.27 0 top
PS:U$1  MCP1824T-3302E/OT  [SOT95P270X145-5N]  7.76,27.82 270 top
PS:U$3  PMF370XN  [SOT323(SC-70)]  9.02,32.95 180 top
UC:C1  [C0805]  10.32,21.17 0 top
UC:C2  0.1uF  [C0805]  15.8,22.35 90 top
UC:C3  10uF  [C0805]  23.86,29.77 90 top
UC:C4  0.1uF  [C0805]  20.74,9.91 270 top
UC:C5  0.1uF  [C0805]  34.52,19.82 270 top
UC:C6  27pF  [C0805]  24.75,6.51 0 top
UC:C7  27pF  [C0805]  28.83,6.5 180 top
UC:JP1  PICKIT  [1X06/90]  -1.83,13.97 90 top
UC:JP2  UART_PC  [1X04/90]  23.19,-1.91 180 top
UC:LED1  GREEN  [CHIPLED_0805]  49.61,2.07 90 top
UC:LED2  GREEN  [CHIPLED_0805]  33.49,28.78 180 top
UC:R1  330Ω  [R0805]  10.32,19.02 0 top
UC:R2  10kΩ  [R0805]  7.11,20.02 90 top
UC:R3  53.6Ω  [R0805]  31.56,28.83 270 top
UC:R6  53.6Ω  [R0805]  49.61,4.33 180 top
UC:R7  10kΩ  [R0805]  16.6,26.44 180 top
UC:U1  DSPIC33EP512MC504  [TQFP44]  24.62,20.44 270 top
UC:U2  XTAL_ABLS7M2  [XTAL_ABLS7M2]  26.75,9.82 0 top

### Tracks (layer width: path | path; a pad name or v marks a point on that pad's centre or on a via)
+3V3
  Top 0.254: PS:R2.2 10.78,24.27 | UC:U1.28 24.64,14.72 24.64,13.21 24.13,12.7 23.11,12.7 21.28,10.86 UC:C4.1 20.68,10.92 | BT:U$1.23 54.99,12.82 BT:C1.1 54.74,9.4 | 18.79,20.32 UC:U1.17 | 11.57,24.24 PS:C2.2 11.1,24.28 | 15.74,21.34 UC:C2.1 | UC:U1.40 31.33,21.24 32.26,20.42 33.7,20.42 UC:C5.1 36.58,21.55 36.58,21.59 | 40.64,10.92 40.64,9.84 BTN:U1.5 | 14.22,15.75 7.11,15.75 5.15,17.71 5.15,17.78 UC:JP1.5 | UC:R2.2 7.11,21.59 8.13,22.61 11.68,22.61 12.06,22.99
  Top 0.305: UC:C2.1 16.96,21.4 18.03,20.32 18.79,20.32 | 11.57,24.24 14.48,21.34 15.74,21.34 | 40.64,10.92 46.48,10.92 48.01,9.4 54.74,9.4
  Top 0.406: BTN:U1.5 43.75,9.41 44.31,8.85 44.31,4.3 BTN:R1.2 | PS:U$1.5 PS:R2.2 | PS:R2.2 11.06,24.27 PS:C2.2 | 40.64,10.92 37.34,14.22 37.34,20.83 36.58,21.59 36.58,29.72 33.78,32.51 22.1,32.51 18.54,28.96 14.99,28.96 13.21,27.18 13.21,25.15 12.34,24.28 11.1,24.28 | 10.78,24.27 12.06,22.99 14.22,20.83 14.22,15.75 14.22,14.73 18.03,10.92 20.68,10.92
BT:N$6
  Top 0.254: BT:LED2.A 39.21,23.08 BT:R3.1
BT:N$7
  Top 0.254: BT:LED3.A 39.23,20.44 BT:R4.1
BT:N$8
  Top 0.254: BT:R1.1 39.42,14.74 BT:LED1.A
BTN:N$1
  Top 0.406: BTN:R2.2 BTN:R1.1 | BTN:U$1.2 43.11,6.15 42.31,5.35 42.31,4.2 BTN:R1.1 | BTN:R1.1 42.16,2.67 BTN:PAIRING_SW.P$2
BTN:N$2
  Top 0.406: BTN:R2.1 BTN:C1.2 37.91,6.4 37.91,8.35 38.31,8.75 BTN:U1.2 43.01,8.75 BTN:U$1.1
GND  (via drill 0.5)
  Top 0.254: UC:U1.29 25.42,13.15 v25.22,12.62 | UC:R7.2 15.65,26.32 | UC:C2.2 15.8,23.82 | UC:C1.2 12.35,21.17 v12.7,20.83 | BTN:C1.1 40.08,6.15 v41.4,5.59 | UC:C5.2 35.38,18.87 v36.32,19.3 | BT:LED1.C 42.24,14.66 v42.93,13.97 | BT:LED3.C 41.98,18.72 v42.6,18.44
  Top 0.406: UC:U1.16 18,21.24 17.35,21.89 17.35,22.86 17.02,23.19 15.91,23.19 UC:C2.2
  Bottom 0.254: v41.4,5.59 41.66,5.33 | v42.93,13.97 42.42,14.48 | v42.6,18.44 42.93,18.29
  other vias: 15.8,24.89
  pour Top (isolate 0.254): 0,40.39 60.2,40.39 60.2,0 0,0
  pour Bottom (isolate 0.254): 0,40.39 60.2,40.39 60.2,0 0,0
N$1  (via drill 0.5)
  Top 0.254: UC:U1.36 31.23,18.04 31.75,17.53 31.75,15.49 v32.51,14.73 | BTN:U1.4 41.08,7.44 v41.91,6.6
  Bottom 0.254: v41.91,6.6 40.64,6.6 v32.51,14.73
N$2  (via drill 0.5)
  Top 0.254: UC:U1.27 23.82,16.96 v24.13,17.27 | v47.5,15.49 47.5,15.75 46.48,16.76 45.66,16.76 BT:U$1.14
  Bottom 0.254: v24.13,17.27 34.8,17.27 39.37,12.7 44.7,12.7 v47.5,15.49
N$5  (via drill 0.5)
  Top 0.254: v7.37,35.05 7.37,36.2 PS:LED1.A | 9.76,31.09 v9.65,30.99 9.8,31.14 | 25.36,35.85 OFF-BOARD_PWR.2 | PS:U$1.3 6.82,30.39 7.11,30.68 8.33,30.68 8.7,30.31 PS:U$1.1
  Top 0.406: PS:U$1.1 9.65,29.96 v9.65,30.99 | 9.8,31.14 PS:C1.2 12.77,32.11 13.3,32.64 17.14,32.64 18.28,33.78 PS:POWER_SW.1 25.66,35.85 OFF-BOARD_PWR.2
  Bottom 0.254: v9.65,30.99 9.65,31.24 7.37,33.53 v7.37,35.05
N$6  (via drill 0.5)
  Top 0.254: UC:U1.38 32.68,19.64 32.77,19.56 32.77,17.53 v38.68,11.58 | v49.28,10.92 49.28,12.9 BT:U$1.18
  Bottom 0.406: v38.68,11.58 39.45,10.92 v49.28,10.92
N$7  (via drill 0.5)
  Top 0.254: v51.56,28.7 51.56,24.51 BT:U$1.5 | UC:U1.5 25.42,30.5 v25.65,30.73
  Bottom 0.254: v25.65,30.73 49.53,30.73 v51.56,28.7
N$8  (via drill 0.5)
  Top 0.254: UC:U1.4 v26.22,29.65 v26.21,29.66 | v50.29,28.19 50.29,24.58 BT:U$1.6
  Bottom 0.254: v26.21,29.66 48.82,29.66 v50.29,28.19
N$9  (via drill 0.5)
  Top 0.254: UC:U1.41 32.26,22.04 v32.51,21.79 | v43.69,15.75 BT:U$1.15
  Bottom 0.254: v43.69,15.75 38.1,15.75 32.26,21.59 32.31,21.59 v32.51,21.79
N$10  (via drill 0.5)
  Top 0.254: 26.92,26.14 UC:U1.3 27.02,28.54 v27.18,28.7 | BT:U$1.7 49.28,24.61 v49.28,27.43 47.86,28.85 BT:R2.2
  Bottom 0.254: v49.28,27.43 49.28,28.19 48.51,28.96 27.43,28.96 v27.18,28.7
N$11  (via drill 0.5)
  Top 0.254: UC:U1.2 27.82,27.56 v27.94,27.69 | v48.01,26.92 48.01,24.54 BT:U$1.8
  Bottom 0.254: v27.94,27.69 47.24,27.69 v48.01,26.92
N$12  (via drill 0.5)
  Top 0.254: UC:U1.44 30.79,24.44 v32,25.15 | BT:U$1.10 45.13,21.84 v43.43,21.84 42.35,22.93 BT:R3.2
  Bottom 0.254: v32,25.15 35.05,25.15 38.35,21.84 v43.43,21.84
N$13  (via drill 0.5)
  Top 0.254: UC:U1.43 31.52,23.64 v32,24.03 | BT:U$1.11 45.2,20.57 43.49,20.57 v43.43,20.63 43.34,20.53 BT:R4.2
  Bottom 0.254: v32,24.03 34.64,24.03 34.64,23.96 38,20.6 43.41,20.6 v43.43,20.63
N$14  (via drill 0.5)
  Top 0.254: UC:U1.42 31.99,22.84 v32,22.86 | BT:U$1.12 45.27,19.56 43.69,19.56 v43.43,19.3 43.43,18.03 42.12,16.72 BT:R1.2
  Bottom 0.254: v32,22.86 34.29,22.86 37.85,19.3 v43.43,19.3
N$15  (via drill 0.5)
  Top 0.254: v17.78,14.73 20.61,14.73 UC:U1.23 | v8.64,6.6 8.64,4.76 ANALOG_SENSOR.1
  Bottom 0.254: v17.78,14.73 16.76,14.73 v8.64,6.6
N$16  (via drill 0.5)
  Top 0.254: 9.77,4.94 ANALOG_SENSOR.2 9.91,4.78 v9.91,6.35 | v17.78,12.95 20.83,12.95 21.34,13.46 21.34,14.66 UC:U1.24
  Bottom 0.254: v17.78,12.95 16.76,12.95 v9.91,6.35
PS:BATT_V+
  Top 0.254: 15.75,35.82 PS:POWER_SW.2 | 7.9,33.53 PS:U$3.1
  Top 0.406: 15.75,35.82 15.75,34.04 15.24,33.53 12.45,33.53 11.43,34.54 9.91,34.54 8.96,33.6 PS:U$3.1 | PS:BATTERY.1 6.51,33.87 6.86,33.53 7.9,33.53
PS:BATT_V-
  Top 0.406: PS:BATTERY.2 6.49,32.62 6.86,32.26 7.93,32.26 PS:U$3.2
PS:N$3
  Top 0.254: PS:LED1.C 9.39,38.88 PS:R1.2
PS:PWRGD
  Top 0.254: 6.82,24.28 PS:R2.1
  Top 0.406: PS:U$1.4 6.82,24.28
PWM_1  (via drill 0.5)
  Top 0.254: UC:U1.10 21.42,27.35 21.21,27.56 21.08,27.69 v21.08,28.45 | v34.8,33.78 34.8,35.45 MOTOR_DRIVERS.2
  Bottom 0.254: v34.8,33.78 34.29,33.27 21.59,33.27 21.08,32.77 v21.08,28.45
PWM_2  (via drill 0.5)
  Top 0.254: UC:U1.8 23.02,27.02 22.35,27.69 v22.35,29.21 | v36.07,33.27 36.07,35.47 MOTOR_DRIVERS.1
  Bottom 0.254: v36.07,33.27 35.05,32.26 22.86,32.26 22.35,31.75 v22.35,29.21
UC:!MCLR
  Top 0.254: UC:C1.1 UC:R1.1 9.32,19.07 UC:R2.1 7.09,19.05 6.6,19.05 5.4,20.25 5.4,20.32 UC:JP1.6
UC:LED1  (via drill 0.5)
  Top 0.254: UC:R6.2 v47,4.33 v46.99,4.32 | v33.02,16 32.26,16.76 32.26,18.29 31.75,18.8 30.37,18.8 UC:U1.37
  Bottom 0.254: v46.99,4.32 46.23,4.32 41.66,8.89 40.13,8.89 v33.02,16
UC:LED2
  Top 0.254: UC:U1.1 28.62,26.21 29.89,26.21 UC:R3.2
UC:N$1  (via drill 0.5)
  Top 0.254: UC:R1.2 v13.21,19.05 | UC:U1.18 18.83,19.56 17.78,19.56 17.27,19.05 v17.02,19.05
  Bottom 0.254: v13.21,19.05 v17.02,19.05
UC:N$3
  Top 0.254: UC:U1.7 23.75,26.21 23.75,28.72 UC:C3.1
UC:N$4
  Top 0.254: UC:R3.1 33.44,29.78 UC:LED2.A
UC:N$10
  Top 0.254: UC:R6.1 50.56,2.17 UC:LED1.A
UC:OSC1
  Top 0.254: UC:U1.30 26.16,14.69 26.16,10.92 25.06,9.82 UC:U2.1 23.8,9.61 UC:C6.1
UC:OSC2
  Top 0.254: UC:U1.31 27,14.73 27,10.9 28.08,9.82 UC:U2.2 29.78,9.53 UC:C7.1
UC:PGC  (via drill 0.5)
  Top 0.254: UC:U1.22 17.46,16.44 v17.02,16 | v8.57,10.22 UC:JP1.2
  Bottom 0.254: v8.57,10.22 9.31,10.22 14.22,16 v17.02,16
UC:PGD  (via drill 0.5)
  Top 0.254: UC:U1.21 16.79,17.24 v16.76,17.27 | v8.53,12.75 1.98,12.68 UC:JP1.3
  Bottom 0.254: v16.76,17.27 9.65,17.27 v8.53,12.75
UC:UART2_RX  (via drill 0.5)
  Top 0.254: UC:U1.33 28.94,14.74 v30.23,13.46 | v23.11,3.81 23.11,3.1 UC:JP2.3
  Bottom 0.254: v30.23,13.46 33.02,10.67 33.02,5.84 32,4.83 23.88,4.83 v23.11,3.81
UC:UART2_TX  (via drill 0.5)
  Top 0.254: UC:U1.34 30.48,16.44 v30.48,15.49 | v25.91,3.81 25.91,3.35 UC:JP2.2
  Bottom 0.254: v30.48,15.49 30.48,14.99 34.04,11.43 34.04,5.33 32.51,3.81 v25.91,3.81
UC:UNUSED
  Top 0.254: 22.35,26.14 UC:U1.9 22.22,24.76 21.21,23.75 | UC:U1.25 22.22,20.07 | UC:U1.26 23.02,21.84 23.02,21.94 | UC:U1.32 27.82,17.14 27.92,17.24 UC:U1.35 | 19.59,25.11 19.56,25.15 19.56,25.4 | UC:U1.20 20.2,18.04 21,18.84 UC:U1.19 | 17.58,26.42 UC:R7.1
  Top 0.406: UC:U1.15 UC:U1.14 UC:U1.13 UC:U1.12 | UC:U1.12 18.57,24.44 | UC:U1.11 19.72,25.24 | 19.72,25.24 19.59,25.11 UC:U1.12 | 19.72,25.24 21.21,23.75 23.02,21.94 27.82,17.14 | 23.02,21.84 22.22,21.04 22.22,20.07 21,18.84 | 19.56,25.4 18.54,26.42 17.58,26.42

### Text on the board
Top: V1.0
Bottom: V1.0
tPlace: + | OFF | ON | POWER | ON | V+ | GND | PWM1 | PWM2 | - | PICKIT | !MCLR | 3V3 | GND | PGD | PGC | NC | NC | RX | TX | GND | UART